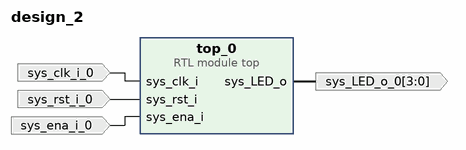
[diagram p0: block diagram of the top level]
# Vivado block design design_2, xc7z010clg400-1, Vivado 2017.4
create_bd_design design_2

create_bd_port -dir I sys_clk_i_0
create_bd_port -dir I sys_rst_i_0
create_bd_port -dir I sys_ena_i_0
create_bd_port -dir O -from 3 -to 0 sys_LED_o_0

create_bd_cell -type module -reference top top_0

# ---- connections ----

connect_bd_net -net sys_clk_i_0_1 [get_bd_ports sys_clk_i_0] [get_bd_pins top_0/sys_clk_i]
connect_bd_net -net sys_rst_i_0_1 [get_bd_ports sys_rst_i_0] [get_bd_pins top_0/sys_rst_i]
connect_bd_net -net sys_ena_i_0_1 [get_bd_ports sys_ena_i_0] [get_bd_pins top_0/sys_ena_i]
connect_bd_net [get_bd_pins top_0/sys_LED_o] [get_bd_ports sys_LED_o_0]

validate_bd_design
save_bd_design
